# EAGLE design BatteryV8 (EAGLE 9.6.2)
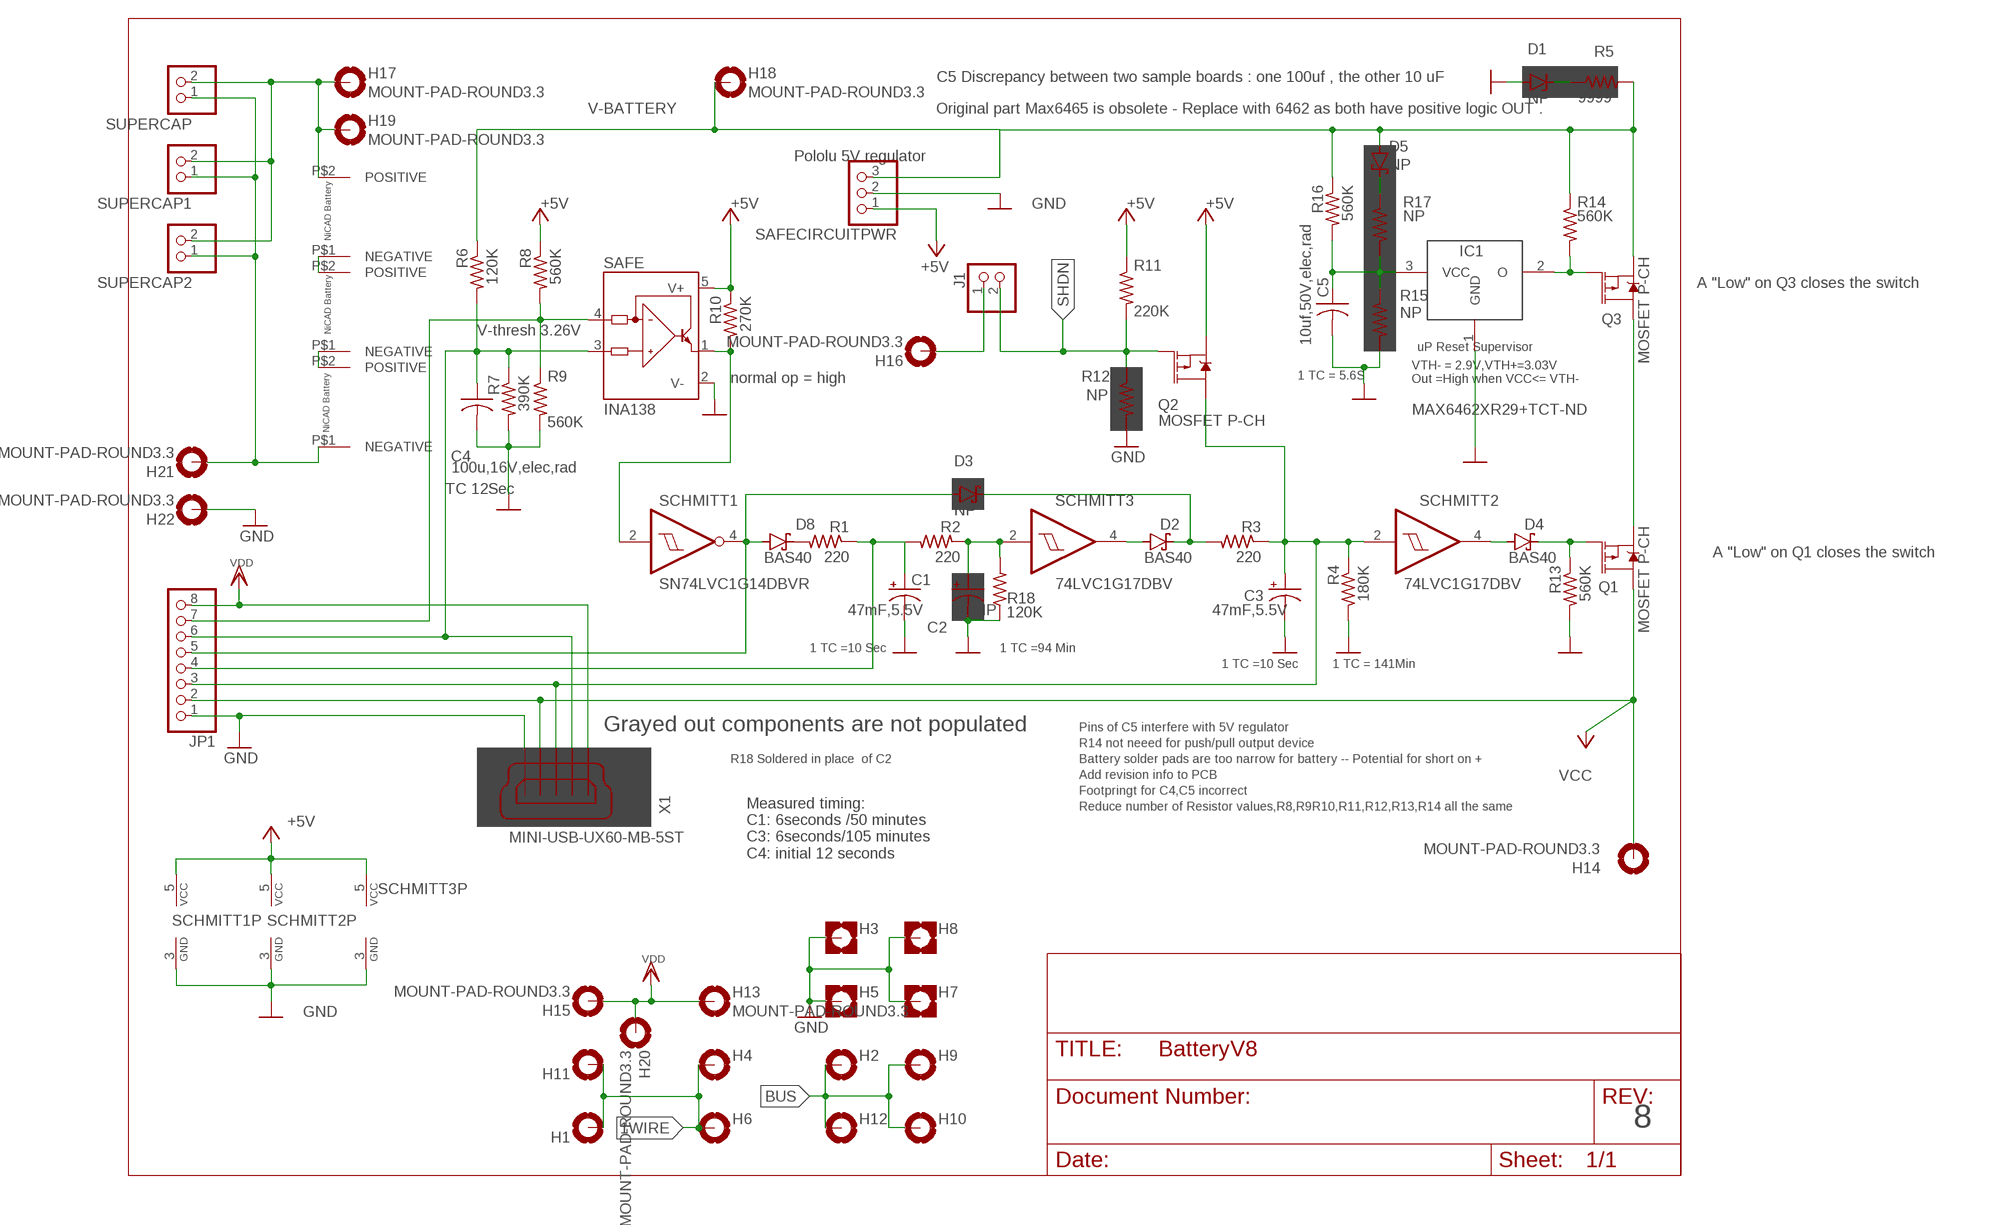
[diagram p0: schematic, sheet 1]

## Parts
C1  47mF,5.5V  CPOL-US153CLV-1010  [153CLV-1010]
C2  NP  CPOL-US153CLV-1010  [153CLV-1010]
C3  47mF,5.5V  CPOL-US153CLV-1010  [153CLV-1010]
C4  100u,16V,elec,rad  C-US050-030X075  [C050-030X075]
C5  10uf,50V,elec,rad  C-US050-030X075  [C050-030X075]
D1  NP  1N821  [DO35Z10]
D2  BAS40  [SOT23]
D3  NP  BAS40  [SOT23]
D4  BAS40  [SOT23]
D5  NP  BAS40  [SOT23]
D8  BAS40  [SOT23]
H1  MOUNT-PAD-ROUND3.3  [3,3-PAD]
H2  MOUNT-PAD-ROUND3.3  [3,3-PAD]
H3  MOUNT-PAD-SQUARE3.3  [3,3-PAD-SQUARE]
H4  MOUNT-PAD-ROUND3.3  [3,3-PAD]
H5  MOUNT-PAD-SQUARE3.3  [3,3-PAD-SQUARE]
H6  MOUNT-PAD-ROUND3.3  [3,3-PAD]
H7  MOUNT-PAD-SQUARE3.3  [3,3-PAD-SQUARE]
H8  MOUNT-PAD-SQUARE3.3  [3,3-PAD-SQUARE]
H9  MOUNT-PAD-ROUND3.3  [3,3-PAD]
H10  MOUNT-PAD-ROUND3.3  [3,3-PAD]
H11  MOUNT-PAD-ROUND3.3  [3,3-PAD]
H12  MOUNT-PAD-ROUND3.3  [3,3-PAD]
H13  MOUNT-PAD-ROUND3.3  [3,3-PAD]
H14  MOUNT-PAD-ROUND3.3  [3,3-PAD]
H15  MOUNT-PAD-ROUND3.3  [3,3-PAD]
H16  MOUNT-PAD-ROUND3.3  [3,3-PAD]
H17  MOUNT-PAD-ROUND3.3  [3,3-PAD]
H18  MOUNT-PAD-ROUND3.3  [3,3-PAD]
H19  MOUNT-PAD-ROUND3.3  [3,3-PAD]
H20  MOUNT-PAD-ROUND3.3  [3,3-PAD]
H21  MOUNT-PAD-ROUND3.3  [3,3-PAD]
H22  MOUNT-PAD-ROUND3.3  [3,3-PAD]
IC1  MAX6462XR29T  EDGECUBE_MAX6465  [EDGECUBE_SC70-3]
J1  PINHD-1X2  [1X02]
JP1  PINHD-1X8  [1X08]
Q1  MOSFET P-CH  MOSFET_PCH-SI2309DS  [SOT23-3]
Q2  MOSFET P-CH  MOSFET_PCH-SI2309DS  [SOT23-3]
Q3  MOSFET P-CH  MOSFET_PCH-SI2309DS  [SOT23-3]
R1  220  R-US_R0805  [R0805]
R2  220  R-US_R0805  [R0805]
R3  220  R-US_R0805  [R0805]
R4  180K  R-US_R0805  [R0805]
R5  9999  R-US_0207/10  [0207/10]
R6  120K  R-US_R0805  [R0805]
R7  390K  R-US_R0805  [R0805]
R8  560K  R-US_R0805  [R0805]
R9  560K  R-US_R0805  [R0805]
R10  270K  R-US_R0805  [R0805]
R11  220K  R-US_R0805  [R0805]
R12  NP  R-US_R0805  [R0805]
R13  560K  R-US_R0805  [R0805]
R14  560K  R-US_R0805  [R0805]
R15  NP  R-US_R0805  [R0805]
R16  560K  R-US_R0805  [R0805]
R17  NP  R-US_R0805  [R0805]
R18  120K  R-US_R0805  [R0805]
SAFE  INA138  [SOT23-5]
SAFECIRCUITPWR  PINHD-1X3  [1X03]
SCHMITT1  SN74LVC1G14DBVR  74AUC1G14DBV  [SOT23-5]
SCHMITT2  74LVC1G17DBV  [SOT23-5]
SCHMITT3  74LVC1G17DBV  [SOT23-5]
SUPERCAP  PINHD-1X2  [1X02]
SUPERCAP1  PINHD-1X2  [1X02]
SUPERCAP2  PINHD-1X2  [1X02]
U$5  JST-WATCH_AA-BATT  [JST-WATCH_AA-BATT]
U$6  JST-WATCH_AA-BATT  [JST-WATCH_AA-BATT]
U$7  JST-WATCH_AA-BATT  [JST-WATCH_AA-BATT]
X1  MINI-USB-UX60-MB-5ST  [UX60-MB-5ST]

## Nets
1WIRE: H1.B3,3(MOUNT) H4.B3,3(MOUNT) H6.B3,3(MOUNT) H11.B3,3(MOUNT)
+5V: Q2.2(S) R8.1 R10.1 R11.1 SAFE.5(V+) SAFECIRCUITPWR.1 SCHMITT1.5(VCC) SCHMITT2.5(VCC) SCHMITT3.5(VCC) ; supply symbol labelled +3V3
BUS: H2.B3,3(MOUNT) H9.B3,3(MOUNT) H10.B3,3(MOUNT) H12.B3,3(MOUNT)
GND: C1.- C2.- C3.- C4.2 C5.2 D1.A H3.B3,3(MOUNT) H5.B3,3(MOUNT) H7.B3,3(MOUNT) H8.B3,3(MOUNT) H22.B3,3(MOUNT) IC1.1(GND) JP1.1 R4.2 R7.2 R9.2 R12.2 R13.2 R15.2 R18.1 SAFE.2(V-) SAFECIRCUITPWR.2 SCHMITT1.3(GND) SCHMITT2.3(GND) SCHMITT3.3(GND) X1.5
N$1: C3.+ JP1.3 Q2.3(D) R3.1 R4.1 SCHMITT2.2(I) X1.3
N$2: D8.3(C) R1.2
N$3: C1.+ JP1.4 R1.1 R2.2
N$4: D4.1(A) SCHMITT2.4(O)
N$5: D5.3(C) R17.1
N$6: C2.+ R2.1 R18.2 SCHMITT3.2(I)
N$7: C4.1 JP1.6 R6.2 R7.1 SAFE.3(IN+) X1.2
N$8: H21.B3,3(MOUNT) SUPERCAP1.1 SUPERCAP2.1 SUPERCAP.1 U$5.P$1(NEGATIVE)
N$9: D1.C R5.1
N$10: D2.1(A) SCHMITT3.4(O)
N$11: R10.2 SAFE.1(OUT) SCHMITT1.2(I)
N$12: D2.3(C) D3.3(C) R3.2
N$13: JP1.7 R8.2 R9.1 SAFE.4(IN-)
N$15: D4.3(C) Q1.1(G) R13.1
N$16: IC1.2(O) Q3.1(G) R14.2
N$17: C5.1 IC1.3(VCC) R15.1 R16.2 R17.2
N$18: U$5.P$2(POSITIVE) U$6.P$1(NEGATIVE)
N$19: H17.B3,3(MOUNT) H19.B3,3(MOUNT) SUPERCAP1.2 SUPERCAP2.2 SUPERCAP.2 U$7.P$2(POSITIVE)
N$20: Q1.2(S) Q3.3(D)
N$21: U$6.P$2(POSITIVE) U$7.P$1(NEGATIVE)
N$23: H16.B3,3(MOUNT) J1.1
N$42: D3.1(A) D8.1(A) JP1.5 SCHMITT1.4(O)
SHDN: J1.2 Q2.1(G) R11.2 R12.1
V-BATTERY: D5.1(A) H18.B3,3(MOUNT) Q3.2(S) R5.2 R6.1 R14.1 R16.1 SAFECIRCUITPWR.3
VCC: H14.B3,3(MOUNT) JP1.2 Q1.3(D) X1.4
VDD: H13.B3,3(MOUNT) H15.B3,3(MOUNT) H20.B3,3(MOUNT) JP1.8 X1.1

## Notes on the sheet
- C5 Discrepancy between two sample boards : one 100uf , the other 10 uF
- Original part Max6465 is obsolete - Replace with 6462 as both have positive logic OUT .
- Pololu 5V regulator
- NiCAD Battery
- IC1
- A "Low" on Q3 closes the switch
- NiCAD Battery | V-thresh 3.26V
- uP Reset Supervisor
- normal op = high | 1 TC = 5.6S
- VTH- = 2.9V,VTH+=3.03V
  Out =High when VCC<= VTH-
- NiCAD Battery
- TC 12Sec
- A "Low" on Q1 closes the switch
- 1 TC =10 Sec | 1 TC =94 Min
- 1 TC =10 Sec | 1 TC = 141Min
- Grayed out components are not populated | Pins of C5 interfere with 5V regulator
- R14 not neeed for push/pull output device
- R18 Soldered in place  of C2 | Battery solder pads are too narrow for battery -- Potential for short on +
- Add revision info to PCB
- Footpringt for C4,C5 incorrect
- Reduce number of Resistor values,R8,R9R10,R11,R12,R13,R14 all the same
- Measured timing:
  C1: 6seconds /50 minutes
  C3: 6seconds/105 minutes
  C4: initial 12 seconds
- 8

## Library data of the parts
C1 C3 = rcl:CPOL-US: POLARIZED CAPACITOR, American symbol; DIGIKEY: 399-16033-1-ND; SPICEPREFIX: C
C2 = rcl:CPOL-US: POLARIZED CAPACITOR, American symbol; SPICEPREFIX: C
C4 = adafruit:C-US: CAPACITOR, American symbol; DIGIKEY: 399-6648-1-ND
C5 = adafruit:C-US: CAPACITOR, American symbol; DIGIKEDY: P807-ND
D1 = diode:1N821: Reference DIODE temperature compensated, 6,2 V
D2 D4 D8 = diode:BAS40: Silicon Schottky Diodes General-purpose diode for high-speed switching; DIGIKEY: BAS40-04fdict-ND; TOPMARK: 88Y
D3 = diode:BAS40: Silicon Schottky Diodes General-purpose diode for high-speed switching; DIGIKEY: BAS40-04fdict-ND
D5 = diode:BAS40: Silicon Schottky Diodes General-purpose diode for high-speed switching
H1 H2 H4 H6 H9-H22 = holes:MOUNT-PAD-ROUND: MOUNTING PAD, round
H3 H5 H7 H8 = holes:MOUNT-PAD-SQUARE: MOUNTING PAD, square
IC1 = BatteryV8:EDGECUBE_MAX6465; DIGIKEY: MAX6462XR29+TCT-ND; TOPMARK: AMW
J1 SUPERCAP SUPERCAP1 SUPERCAP2 = pinhead:PINHD-1X2: PIN HEADER
JP1 = pinhead:PINHD-1X8: PIN HEADER
Q1-Q3 = SparkFun-DiscreteSemi:MOSFET_PCH: P-channel MOSFETs Voltage controlled devices that allow control of high current outputs. SparkFun Products: SparkFun ESP32 Thing <https://www.sparkfun.com/products/13907> SparkFun ESP8266 Thing <https://www.sparkfun.com/products/13231>; DIGIKEY: SSM3J338RLFCT-ND; PROD_ID: TRANS-08285; TOPMARK: KFQ; VALUE: 1.1A/60V/600mΩ
R1-R18 = rcl:R-US_: RESISTOR, American symbol; SPICEPREFIX: R
SAFE = burr-brown:INA138: High-Side Measurement Current Shunt Monitor; MF: TEXAS INSTRUMENTS; MOUSER: 595-INA138NA3K; MPN: INA138NA/250; OC_FARNELL: 1564888; OC_NEWARK: 80K5906; TOPMARK: 15F2
SAFECIRCUITPWR = pinhead:PINHD-1X3: PIN HEADER
SCHMITT1 = 74xx-little-us:74*1G14: Single Schmitt-Trigger Inverter Gate; DIGIKET: 296-11607-1-ND; TOPMARK: U14F,U14R
SCHMITT2 SCHMITT3 = 74xx-little-us:74*1G17: Single Schmitt-Trigger Buffer; DIGIKEY: 296-11933-1-ND; TOPMARK: C175
U$5-U$7 = BatteryV8:JST-WATCH_AA-BATT
X1 = con-hirose:MINI-USB-: MINI USB Connector Source: http://www.hirose.co.jp/cataloge_hp/e24000019.pdf; OC_FARNELL: unknown; OC_NEWARK: unknown

## Board
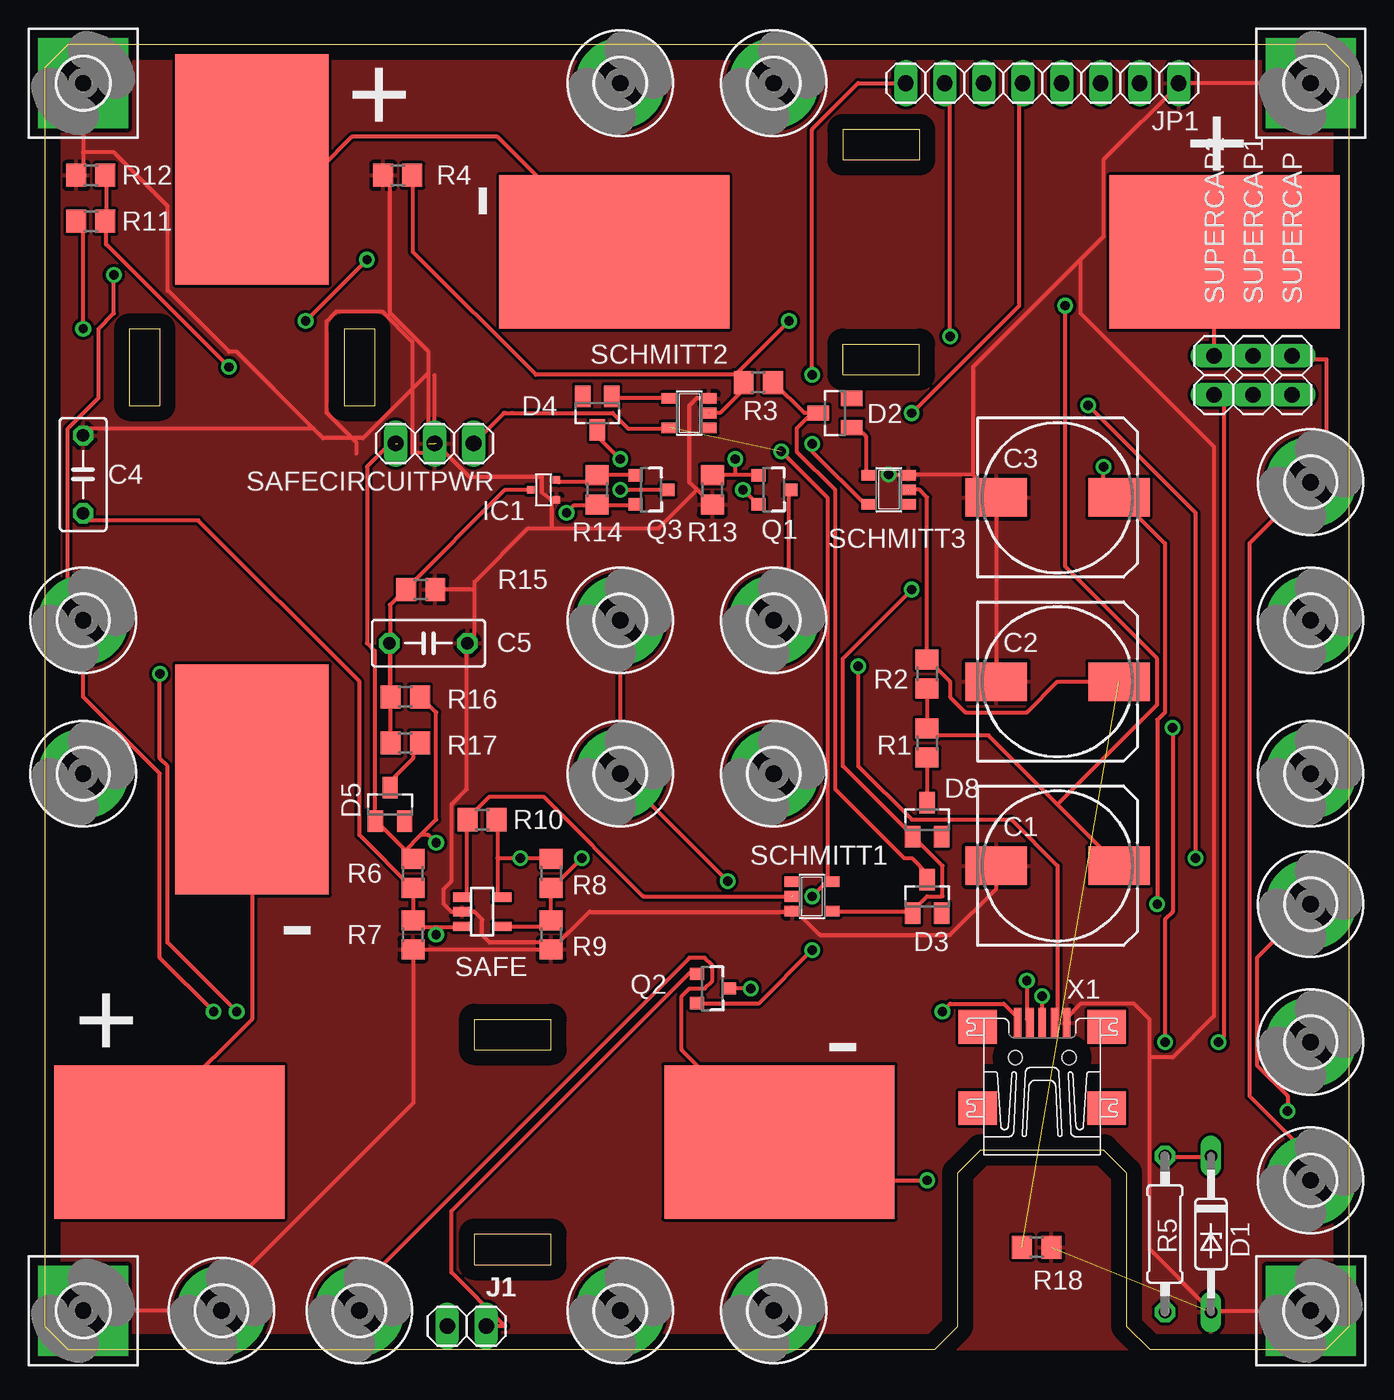
[diagram p1: board, top side]
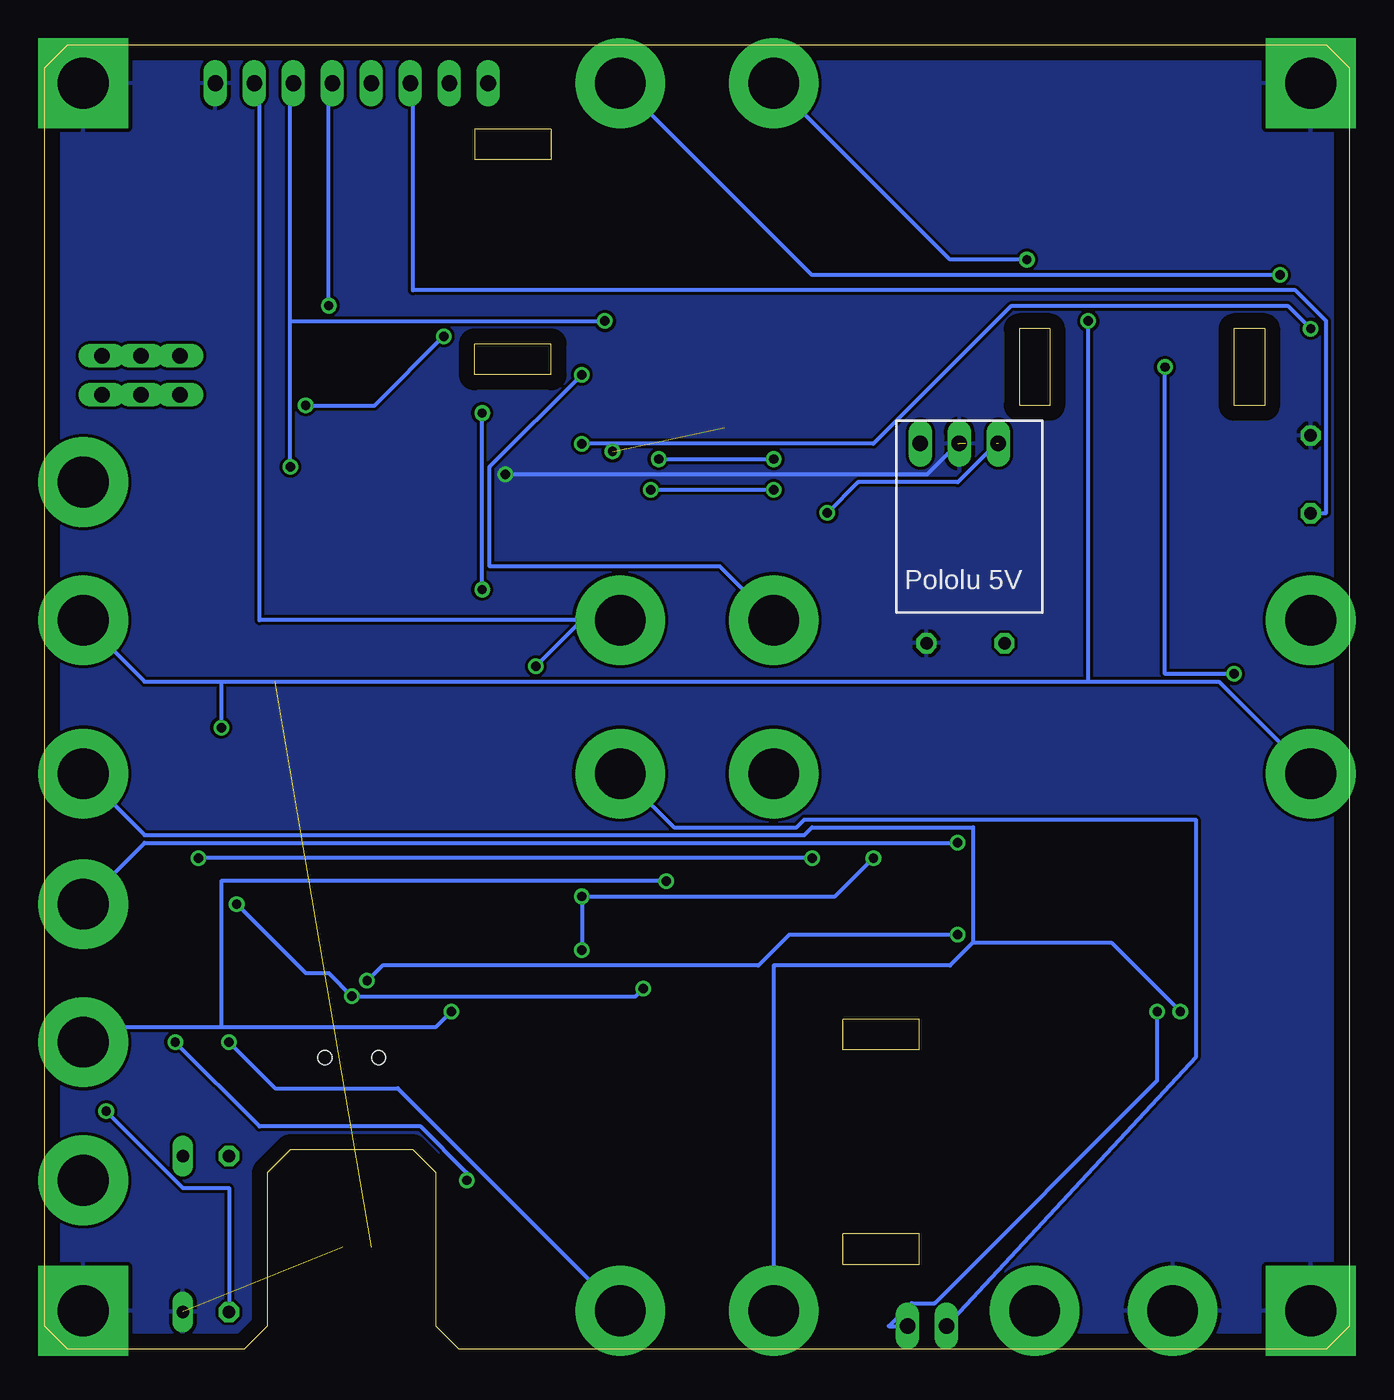
[diagram p2: board, bottom side, seen from below]

Size 85 x 85 mm. Coordinates in mm from the lower left corner, seen from the top.
Outline: 0,1.5 1.5,0 58,0 59.5,1.5 59.5,11.5 61,13 69,13 70.5,11.5 70.5,1.5 72,0 83.5,0 85,1.5 85,83.5 83.5,85 1.5,85 0,83.5 0,1.5
Outline: 5.5,66.5 5.5,61.5 7.5,61.5 7.5,66.5 5.5,66.5
Outline: 19.5,66.5 19.5,61.5 21.5,61.5 21.5,66.5 19.5,66.5
Outline: 52,79.5 57,79.5 57,77.5 52,77.5 52,79.5
Outline: 52,63.5 57,63.5 57,65.5 52,65.5 52,63.5
Outline: 28,19.5 33,19.5 33,21.5 28,21.5 28,19.5
Outline: 28,5.5 33,5.5 33,7.5 28,7.5 28,5.5
Copper layers (1*16): Top 0.035mm / dielectric 1.5mm / Bottom 0.035mm
Design rules "default *": minimum track width 10mil, minimum drill 24mil, track to track 8mil, track to pad 8mil, pad to pad 8mil, via to via 8mil, smd to smd 8mil, copper to edge 40mil, drill to drill 8mil, minimum pad ring 10mil, minimum via ring 8mil, stop-mask expansion 4mil, vias tented up to drill 0mil, thermal gap 10mil

### Footprints (pad centres in the part's own frame; a part is rotated, then mirrored left to right if it is on the bottom)
153CLV-1010 = smd 4 x 2.5: + 4,0; - -4,0
C050-030X075 = drill 0.813 octagon: 1 -2.54,0; 2 2.54,0
DO35Z10 = drill 0.813 long: A 5.08,0; C -5.08,0
SOT23 = smd 1 x 1.4: 1 -0.95,-1.1; 2 0.95,-1.1; 3 0,1.1
3,3-PAD = drill 3.3 pad 5.842: B3,3 0,0
3,3-PAD-SQUARE = drill 3.3 pad 5.842 square: B3,3 0,0
EDGECUBE_SC70-3 = smd 0.5 x 0.5: 1 -0.838,0.65; 2 -0.838,-0.65; 3 0.838,0
1X02 = drill 1.016 long: 1 -1.27,0; 2 1.27,0
1X08 = drill 1.016 long: 1 -8.89,0; 2 -6.35,0; 3 -3.81,0; 4 -1.27,0; 5 1.27,0; 6 3.81,0; 7 6.35,0; 8 8.89,0
SOT23-3 = smd 0.8 x 0.9: 1 -0.95,-1; 2 0.95,-1; 3 0,1.1
R0805 = smd 1.3 x 1.5: 1 -0.95,0; 2 0.95,0
0207/10 = drill 0.813 octagon: 1 -5.08,0; 2 5.08,0
SOT23-5 = smd 0.6 x 1.2: 1 -0.95,-1.306; 2 0,-1.306; 3 0.95,-1.306; 4 0.95,1.306; 5 -0.95,1.306
1X03 = drill 1.016 long: 1 -2.54,0; 2 0,0; 3 2.54,0
SOT23-5' = smd 0.69 x 0.99: 1 -0.95,-1.29; 2 0,-1.29; 3 0.95,-1.29; 4 0.95,1.3; 5 -0.95,1.3
JST-WATCH_AA-BATT = smd 15 x 10: P$1 19.88,0; P$2 -19.88,0
UX60-MB-5ST = smd 2 x 0.5: 1 2.25,1.6; 2 2.25,0.8; 3 2.25,0; 4 2.25,-0.8; 5 2.25,-1.6 | smd 2.2 x 2.5: M1 -3.3,-4.2; M2 -3.3,4.2; M3 2,4.2; M4 2,-4.2 | hole 0.9: 0,-1.75; 0,1.75

### Placement (x,y rotation side)
C1  66,31.5 0 top
C2  66,43.5 0 top
C3  66,55.5 0 top
C4  2.5,57 90 top
C5  25,46 0 top
D1  76,7.5 270 top
D2  51.5,61 90 top
D3  57.5,29.5 0 top
D4  36,61 180 top
D5  22.5,35.5 0 top
D8  57.5,34.5 0 top
H1  82.5,47.5 0 top
H2  47.5,82.5 0 top
H3  2.5,2.5 0 top
H4  37.5,82.5 0 top
H5  82.5,2.5 0 top
H6  47.5,2.5 0 top
H7  82.5,82.5 0 top
H8  2.5,82.5 0 top
H9  37.5,2.5 0 top
H10  2.5,47.5 0 top
H11  2.5,37.5 0 top
H12  82.5,37.5 0 top
H13  37.5,37.5 180 top
H14  47.5,47.5 180 top
H15  37.5,47.5 180 top
H16  47.5,37.5 180 top
H17  82.5,56.5 0 top
H18  82.5,29 0 top
H19  82.5,11 0 top
H20  82.5,20 0 top
H21  20.5,2.5 0 top
H22  11.5,2.5 0 top
IC1  32.5,56 180 top
J1  27.5,1.5 0 top
JP1  65,82.5 180 top
Q1  47.5,56 270 top
Q2  43.5,23.5 270 top
Q3  39.5,56 270 top
R1  57.5,39.5 270 top
R2  57.5,44 270 top
R3  46.5,63 0 top
R4  23,76.5 180 top
R5  73,7.5 270 top
R6  24,31 270 top
R7  24,27 270 top
R8  33,31 270 top
R9  33,27 270 top
R10  28.5,34.5 180 top
R11  3,73.5 0 top
R12  3,76.5 180 top
R13  43.5,56 270 top
R14  36,56 90 top
R15  24.5,49.5 0 top
R16  23.5,42.5 180 top
R17  23.5,39.5 180 top
R18  64.64,6.64 180 top
SAFE  28.5,28.5 270 top
SAFECIRCUITPWR  25.4,59.02 180 top
SCHMITT1  SN74LVC1G14DBVR  [SOT23-5']  50,29.5 270 top
SCHMITT2  74LVC1G17DBV  [SOT23-5']  42,61 90 top
SCHMITT3  74LVC1G17DBV  [SOT23-5']  55,56 90 top
SUPERCAP  81.28,63.46 90 top
SUPERCAP1  78.74,63.46 90 top
SUPERCAP2  76.2,63.46 90 top
U$5  28,13.5 0 top
U$6  13.5,57 270 top
U$7  57,71.5 180 top
X1  65,19 90 top

### Tracks (layer width: path | path; a pad name or v marks a point on that pad's centre or on a via)
1WIRE  (via drill 0.61)
  Top 0.254: v17,67 v21,71 | v73,20 73,28 73.5,28.5 v73.5,40.5
  Bottom 0.254: H11.B3,3 8.5,43.5 17,43.5 | 73.5,43.5 78.5,43.5 H1.B3,3 | 73.5,43.5 17,43.5 | H4.B3,3 26,71 v21,71 | 17,43.5 v17,67 | H6.B3,3 62,17 70,17 v73,20 | 73.5,43.5 v73.5,40.5
+5V  (via drill 0.61)  (1 unrouted)
  Top 0.254: 29.5,32 29.5,34.5 R10.1 | 29.5,32 29.5,29.5 SAFE.5 | 29.5,32 v31,32 33,32 R8.1 | v50,26 46.5,22.5 42.5,22.5 Q2.2 | 51,30.5 v50,29.5 | SCHMITT2.5 40.5,60 38,60 37,61 30.48,61 30,61 29.93,61 SAFECIRCUITPWR.1 | v50,59 50,58.5 53.5,55 SCHMITT3.5 | v2.5,66.5 2.5,73.5 R11.1 | 51,30.5 51,55.5 v48,58.5 | 51,30.5 SCHMITT1.5
  Bottom 0.254: v50,26 v50,29.5 33.5,29.5 v31,32 | 48,59 31,59 22,68 4,68 v2.5,66.5 | 48,59 v50,59 | 48,59 v48,58.5
BUS  (via drill 0.61)
  Top 0.254: v11,22 7.5,25.5 7.5,37.5 2.5,42.5 H10.B3,3 1.5,48.5 1.5,60 3.5,62 3.5,66.5 4.5,67.5 v4.5,70
  Bottom 0.254: H9.B3,3 37.5,25 26,25 24.5,26.5 | 24.5,26.5 24.5,34 35,34 35.5,33.5 78.5,33.5 H12.B3,3 | v11,22 15.5,26.5 24.5,26.5 | H2.B3,3 35,70 v4.5,70
GND  (via drill 0.61)  (4 unrouted)
  Top 0.254: 72,19 72,6.5 76,2.5 | 72,19 72,21.5 71,22.5 67.5,22.5 66.5,21.5 X1.5 | 76,2.5 H5.B3,3 | 76,2.5 D1.A | 60.5,57 56.5,57 SCHMITT3.3 56,57 v55,57 | 60.5,57 C3.- C2.- | H7.B3,3 74,82.5 | 60.5,57 60.5,64 67.5,71 | 67.5,71 69,72.5 69,77.5 74,82.5 | 74,82.5 JP1.1 | 72,19 73.5,19 76.2,21.7 76.2,58.8 67.5,67.5 67.5,71 | 42.5,56 43.5,55 R13.2 | 42.5,56 42,56.5 42,61.5 42.5,62 43,62 SCHMITT2.3 | 28,49.5 28,46 C5.2 27.5,46 27.5,36.5 26.5,35.5 26.5,30.5 26,30 26,29 26.5,28.5 SAFE.2 28,28.5 28.5,28 28.5,27 29,26.5 33,26.5 R9.2 33,26 | 28,49.5 28,50 31.5,53.5 33.02,53.5 | 28,49.5 R15.2 | 42.5,56 40,53.5 33.02,53.5 | H8.B3,3 2.5,78 | 2.5,78 2.5,76.5 R12.2 | 25,59 25,63.63 | 25,63.63 25,65 22.5,67.5 22.5,76.5 R4.2 | 17.5,60 2.5,60 C4.2 | 25,63.63 20.73,59.37 18.14,59.37 17.5,60 | 2.5,78 4.5,78 8,74.5 8,69 12,65 12.5,65 17.5,60 | 25.5,59 27.64,56.87 32.38,56.87 32.38,55.84 33.02,55.35 | H3.B3,3 H22.B3,3 11.5,3.5 24,16 24,26 | 33,26 35.5,28.5 48.5,28.5 SCHMITT1.3 49,28.5 50.5,27 59,27 62,30 C1.- | 33,26 24,26 | 24,26 R7.2 | IC1.1 33.02,55.35 | 33.02,55.35 33.02,53.5 | 25.4,63.46 SAFECIRCUITPWR.2 24.77,58.38 23.95,58.38 23.95,65.66 21.97,67.64 19.03,67.64 18.36,66.97 18.36,61.03 20.32,59.06 20.32,58.38
  Bottom 0.254: v55,57 27.5,57 25.5,59
  pour Top: 0,0 0,85 85,85 85,0
  pour Bottom: 0,0 0,85 85,85 85,0
N$1  (via drill 0.61)
  Top 0.254: SCHMITT2.2 44,61 46,63 R3.1 | 45,63.5 32,63.5 24,71.5 24,76.5 R4.1 | 45,63.5 45.5,63 R3.1 | v46,23.5 Q2.3 | X1.3 v65,23 | v69,57.5 69,56.5 C3.+ 73,52.5 73,41.5 72.5,41 v72.5,29 | v48.5,67 45,63.5 | 45,63.5 R3.1
  Bottom 0.254: v46,23.5 46.5,23 v65,23 66.5,24.5 68,24.5 v72.5,29 | v69,57.5 69,67 | 69,67 69,82.5 JP1.3 | 69,67 v48.5,67
N$2
  Top 0.254: R1.2 D8.3
N$3  (via drill 0.61)
  Top 0.254: R2.2 R1.1 57.5,40 61.5,40 66,35.5 | C1.+ 66,35.5 | v66.5,68 66.5,51 72.5,45 72.5,42 66,35.5
  Bottom 0.254: v66.5,68 66.5,82.5 JP1.4
N$4
  Top 0.254: SCHMITT2.4 40.5,62 37,62 D4.1
N$5
  Top 0.254: D5.3 22.5,37 24,38.5 24,39.5 R17.1
N$6  (1 unrouted)
  Top 0.254: SCHMITT3.2 57,56 57.5,55.5 57.5,45 | C2.+ 66,43.5 64,41.5 60,41.5 59,42.5 59,43.5 57.5,45 | 57.5,45 R2.1
N$7  (via drill 0.61)
  Top 0.254: 25.5,27.5 27,27.5 SAFE.3 | v64,24 64,21.5 X1.2 | 25.5,27.5 v25.5,27 | C4.1 2.5,54 10,54 20.5,43.5 20.5,33.5 24,30 R6.2 R7.1 24,27.5 25.5,27.5
  Bottom 0.254: v64,24 63,25 38.5,25 36.5,27 v25.5,27 | JP1.6 61,82.5 61,69 3.5,69 1.5,67 1.5,54.5 2.5,54.5 C4.1
N$8  (via drill 0.61)
  Top 0.254: SUPERCAP1.1 SUPERCAP2.1 76.83,61.55 76.83,20.34 v76.5,20 | v57.5,11 50.5,11 48,13.5 U$5.P$1 47.5,13.5 41.5,19.5 41.5,23 42,23.5 43,23.5 43.5,24 43.5,25 43,25.5 42,25.5 20.5,4 H21.B3,3
  Bottom 0.254: SUPERCAP.1 SUPERCAP1.1 | v76.5,20 71,14.5 60.5,14.5 57.5,11.5 v57.5,11
N$9
  Top 0.254: R5.1 73,12.5 76,12.5 D1.C
N$10
  Top 0.254: SCHMITT3.4 53.5,57 53.5,59.5 53,60 D2.1
N$11
  Top 0.254: SCHMITT1.2 39,29.5 32.5,36 29,36 27.5,34.5 | 27.5,34.5 27.5,29.5 SAFE.1 | 27.5,34.5 R10.2
N$12
  Top 0.254: 50,61 49,60 49,58.5 51.5,56 51.5,36.5 56,32 56.5,32 57.5,31 D3.3 | 50,61 49.5,61 47.5,63 R3.2 | 50,61 D2.3
N$13  (via drill 0.61)
  Top 0.254: SAFE.4 30,27.5 33,27.5 R9.1 33,30 | v59,66 59,82.5 JP1.7 | v68,61.5 75,54.5 v75,32 | 33,30 v35,32 | 33,30 R8.2
  Bottom 0.254: v59,66 63.5,61.5 v68,61.5 | v35,32 v75,32
N$15  (via drill 0.61)
  Top 0.254: 45,57 43.5,57 R13.1 | 45,57 46.5,57 Q1.1 | v37.5,58 36,59.5 D4.3 | 45,57 v45,58
  Bottom 0.254: v45,58 v37.5,58
N$16
  Top 0.254: IC1.2 33.5,56.5 36,56.5 R14.2 36,57 38.5,57 Q3.1
N$17
  Top 0.254: 22.5,42.5 22.5,39.5 R17.2 R16.2 | 22.5,46 22.5,42.5 | 22.5,42.5 R16.2 | IC1.3 30,56 23.5,49.5 | 22.5,46 22.5,48.5 23.5,49.5 | 23.5,49.5 R15.1 | R16.2 22.55,46 22.5,46 | 22.5,46 C5.1 22.46,42.5 R16.2
N$18
  Top 0.254: U$6.P$1 13.5,21.5 8.5,16.5 8.5,13.5 U$5.P$2
N$19
  Top 0.254: 78.74,64.5 76.2,64.5 SUPERCAP2.2 76.2,71.5 U$7.P$2 | 78.74,64.5 81.28,64.5 | 81.28,64.5 83.54,64.5 83.54,57.54 H17.B3,3 81,55 78.5,52.5 78.5,16.5 82.5,12.5 H19.B3,3 | 81.28,64.5 SUPERCAP.2 | 78.74,64.5 SUPERCAP1.2
N$20  (via drill 0.61)
  Top 0.254: v37.5,56 Q3.3 | v45.5,56 46.5,55 Q1.2
  Bottom 0.254: v45.5,56 v37.5,56
N$21
  Top 0.254: U$6.P$2 13.5,77 18,77 20,79 29.5,79 37,71.5 U$7.P$1
N$23
  Bottom 0.254: J1.1 10,19 10,34.5 35.5,34.5 36,34 44,34 H16.B3,3
N$42  (via drill 0.61)
  Top 0.254: 56.5,28.5 51.5,28.5 SCHMITT1.4 | 56.5,28.5 57.5,29.5 58.5,29.5 58.5,31.5 57,33 D8.1 56.5,33.5 52,38 52,45 v56.5,49.5 | 56.5,28.5 D3.1 | v56.5,61 63.5,68 63.5,82.5 JP1.5
  Bottom 0.254: v56.5,49.5 v56.5,61
SHDN  (via drill 0.61)
  Top 0.254: 4,73.5 4,76.5 R12.1 | Q2.1 42.5,24.5 42,24.5 26.5,9 26.5,5 30,1.5 J1.2 | 4,73.5 4,72 v12,64 | v7.5,44 7.5,38.5 8,38 8,26.5 v12.5,22 | 4,73.5 R11.2
  Bottom 0.254: v12,64 12,44 v7.5,44 | v12.5,22 12.5,17.5 27,3 28.5,3 30,1.5 J1.2
V-BATTERY  (via drill 0.61)  (1 unrouted)
  Top 0.254: 23.5,32.5 24,32 R6.1 23.5,32.5 | 23.5,32.5 22,34 D5.1 21.5,34.5 21.5,45.5 21,46 21,57.5 22.5,59 22.84,59 SAFECIRCUITPWR.3 | 23.5,32.5 24.5,33.5 | 24.5,33.5 25.5,34.5 25.5,41.5 24.5,42.5 R16.1 | 36,55 38.5,55 Q3.2 | 36,55 34.5,55 v34,54.5 | 36,55 R14.1 | v81,15.5 81,16.5 79,18.5 79,25.5 H18.B3,3 | 24.5,33.5 25,33.5 v25.5,33
  Bottom 0.254: v34,54.5 32,56.5 25.5,56.5 23,59 | R5.2 73,10.5 76,10.5 v81,15.5 | v25.5,33 78.5,33 H18.B3,3
VCC  (via drill 0.61)
  Top 0.254: H14.B3,3 48.5,48.5 48.5,56 Q1.3 | v53,44.5 53,38 56.5,34.5 63,34.5 66,31.5 66,21.5 X1.4
  Bottom 0.254: 50,47.5 v53,44.5 | 50,47.5 71,47.5 71,82.5 JP1.2 | 50,47.5 H14.B3,3
VDD  (via drill 0.61)
  Top 0.254: v58.5,22 59,22.5 62.5,22.5 63.5,21.5 X1.1 | JP1.8 53,82.5 50,79.5 v50,63.5 | H15.B3,3 H13.B3,3 v44.5,30.5
  Bottom 0.254: v58.5,22 59.5,21 73.5,21 | 73.5,21 81.5,21 H20.B3,3 | v50,63.5 56,57.5 56,51 41,51 H15.B3,3 | 73.5,21 73.5,30.5 v44.5,30.5

### Text on the board
tPlace: + | + | - | IC1 | - | + | -
bPlace: Pololu 5V